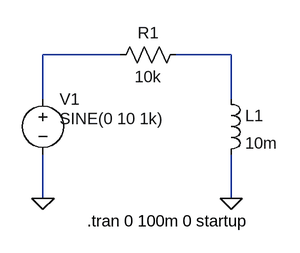
[diagram p0: schematic inductive_reactance.asc]
inductive_reactance.asc, the LTspice schematic file:
Version 4
SHEET 1 880 680
WIRE 144 64 32 64
WIRE 304 64 224 64
WIRE 32 128 32 64
WIRE 304 128 304 64
WIRE 32 272 32 208
WIRE 304 272 304 208
FLAG 304 272 0
FLAG 32 272 0
SYMBOL voltage 32 112 R0
WINDOW 123 24 124 Left 2
WINDOW 39 0 0 Left 0
WINDOW 3 24 44 Left 2
SYMATTR InstName V1
SYMATTR Value SINE(0 10 1k)
SYMBOL res 240 48 R90
WINDOW 0 0 56 VBottom 2
WINDOW 3 32 56 VTop 2
SYMATTR InstName R1
SYMATTR Value 10k
SYMBOL ind 288 112 R0
SYMATTR InstName L1
SYMATTR Value 10m
TEXT 96 304 Left 2 !.tran 0 100m 0 startup

The netlist it stands for:
* inductive_reactance.asc
V1 N001 0 SINE(0 10 1k)
R1 N002 N001 10k
L1 N002 0 10m
.tran 0 100m 0 startup
.backanno
.end